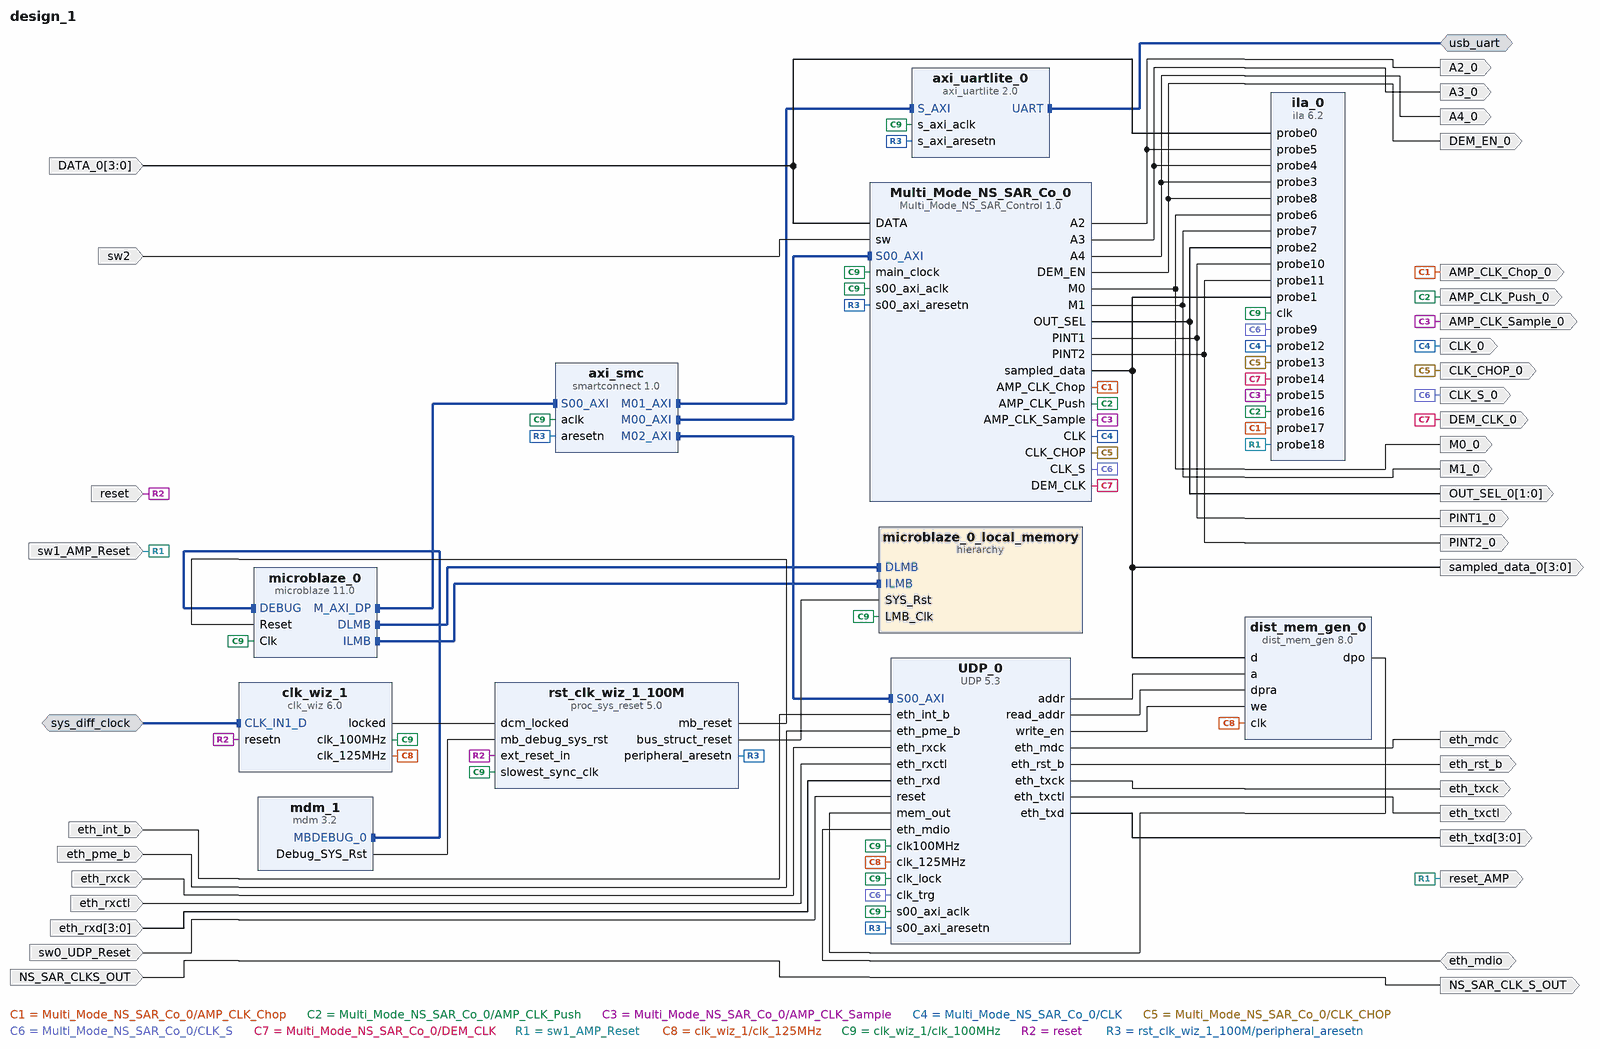
[diagram p0: block diagram of the top level]
# Vivado block design design_1, xc7k325tffg900-2, Vivado 2025.2
create_bd_design design_1

create_bd_intf_port -mode Slave -vlnv xilinx.com:interface:diff_clock_rtl:1.0 sys_diff_clock
set_property -dict {CONFIG.FREQ_HZ 200000000} [get_bd_intf_ports sys_diff_clock]
create_bd_intf_port -mode Master -vlnv xilinx.com:interface:uart_rtl:1.0 usb_uart
create_bd_port -dir I -type rst reset
set_property -dict {CONFIG.POLARITY ACTIVE_LOW} [get_bd_ports reset]
create_bd_port -dir I -from 3 -to 0 DATA_0
create_bd_port -dir O -from 3 -to 0 sampled_data_0
create_bd_port -dir O A4_0
create_bd_port -dir O A3_0
create_bd_port -dir O A2_0
create_bd_port -dir O M0_0
create_bd_port -dir O M1_0
create_bd_port -dir O -from 1 -to 0 OUT_SEL_0
create_bd_port -dir O DEM_EN_0
create_bd_port -dir O CLK_S_0
create_bd_port -dir O PINT1_0
create_bd_port -dir O PINT2_0
create_bd_port -dir O -type clk CLK_0
create_bd_port -dir O CLK_CHOP_0
create_bd_port -dir O -type clk DEM_CLK_0
create_bd_port -dir I eth_int_b
create_bd_port -dir I eth_pme_b
create_bd_port -dir I eth_rxck
create_bd_port -dir I eth_rxctl
create_bd_port -dir I -from 3 -to 0 eth_rxd
create_bd_port -dir O eth_rst_b
create_bd_port -dir O eth_mdc
create_bd_port -dir IO eth_mdio
create_bd_port -dir O eth_txck
create_bd_port -dir O eth_txctl
create_bd_port -dir O -from 3 -to 0 eth_txd
create_bd_port -dir I sw0_UDP_Reset
create_bd_port -dir I sw1_AMP_Reset
create_bd_port -dir O AMP_CLK_Sample_0
create_bd_port -dir O AMP_CLK_Push_0
create_bd_port -dir O AMP_CLK_Chop_0
create_bd_port -dir O -type rst reset_AMP
create_bd_port -dir I NS_SAR_CLKS_OUT
create_bd_port -dir O NS_SAR_CLK_S_OUT
create_bd_port -dir I sw2

create_bd_cell -type ip -vlnv xilinx.com:ip:microblaze:11.0 microblaze_0
set_property -dict [list \
  CONFIG.C_DEBUG_ENABLED 1 \
  CONFIG.C_D_AXI 1 \
  CONFIG.C_D_LMB 1 \
  CONFIG.C_ENABLE_CONVERSION 0 \
  CONFIG.C_I_LMB 1 \
] [get_bd_cells microblaze_0]
create_bd_cell -type hier microblaze_0_local_memory
create_bd_cell -type ip -vlnv xilinx.com:ip:mdm:3.2 mdm_1
create_bd_cell -type ip -vlnv xilinx.com:ip:clk_wiz:6.0 clk_wiz_1
set_property -dict [list \
  CONFIG.CLKIN1_JITTER_PS 50.0 \
  CONFIG.CLKOUT1_DRIVES BUFG \
  CONFIG.CLKOUT1_JITTER 112.316 \
  CONFIG.CLKOUT1_PHASE_ERROR 89.971 \
  CONFIG.CLKOUT2_DRIVES BUFG \
  CONFIG.CLKOUT2_JITTER 107.523 \
  CONFIG.CLKOUT2_PHASE_ERROR 89.971 \
  CONFIG.CLKOUT2_REQUESTED_OUT_FREQ 125.000 \
  CONFIG.CLKOUT2_USED true \
  CONFIG.CLKOUT3_DRIVES BUFG \
  CONFIG.CLKOUT4_DRIVES BUFG \
  CONFIG.CLKOUT5_DRIVES BUFG \
  CONFIG.CLKOUT6_DRIVES BUFG \
  CONFIG.CLKOUT7_DRIVES BUFG \
  CONFIG.CLK_IN1_BOARD_INTERFACE sys_diff_clock \
  CONFIG.CLK_OUT1_PORT clk_100MHz \
  CONFIG.CLK_OUT2_PORT clk_125MHz \
  CONFIG.FEEDBACK_SOURCE FDBK_AUTO \
  CONFIG.MMCM_BANDWIDTH OPTIMIZED \
  CONFIG.MMCM_CLKFBOUT_MULT_F 5.000 \
  CONFIG.MMCM_CLKIN1_PERIOD 5.000 \
  CONFIG.MMCM_CLKIN2_PERIOD 10.0 \
  CONFIG.MMCM_CLKOUT0_DIVIDE_F 10.000 \
  CONFIG.MMCM_CLKOUT1_DIVIDE 8 \
  CONFIG.MMCM_COMPENSATION ZHOLD \
  CONFIG.MMCM_DIVCLK_DIVIDE 1 \
  CONFIG.NUM_OUT_CLKS 2 \
  CONFIG.PRIMITIVE MMCM \
  CONFIG.PRIM_SOURCE Differential_clock_capable_pin \
  CONFIG.RESET_BOARD_INTERFACE reset \
  CONFIG.RESET_PORT resetn \
  CONFIG.RESET_TYPE ACTIVE_LOW \
  CONFIG.USE_BOARD_FLOW true \
] [get_bd_cells clk_wiz_1]
create_bd_cell -type ip -vlnv xilinx.com:ip:proc_sys_reset:5.0 rst_clk_wiz_1_100M
set_property -dict {CONFIG.RESET_BOARD_INTERFACE reset CONFIG.USE_BOARD_FLOW true} [get_bd_cells rst_clk_wiz_1_100M]
create_bd_cell -type ip -vlnv xilinx.com:user:Multi_Mode_NS_SAR_Control:1.0 Multi_Mode_NS_SAR_Co_0
create_bd_cell -type ip -vlnv xilinx.com:ip:smartconnect:1.0 axi_smc
set_property -dict {CONFIG.NUM_MI 3 CONFIG.NUM_SI 1} [get_bd_cells axi_smc]
create_bd_cell -type ip -vlnv xilinx.com:ip:ila:6.2 ila_0
set_property -dict [list \
  CONFIG.C_DATA_DEPTH 8192 \
  CONFIG.C_MONITOR_TYPE Native \
  CONFIG.C_NUM_OF_PROBES 19 \
  CONFIG.C_PROBE0_WIDTH 4 \
  CONFIG.C_PROBE1_WIDTH 8 \
  CONFIG.C_PROBE2_WIDTH 2 \
] [get_bd_cells ila_0]
create_bd_cell -type ip -vlnv xilinx.com:ip:axi_uartlite:2.0 axi_uartlite_0
set_property -dict {CONFIG.UARTLITE_BOARD_INTERFACE usb_uart CONFIG.USE_BOARD_FLOW true} [get_bd_cells axi_uartlite_0]
create_bd_cell -type ip -vlnv xilinx.com:ip:dist_mem_gen:8.0 dist_mem_gen_0
set_property -dict {CONFIG.data_width 8 CONFIG.depth 8192 CONFIG.memory_type simple_dual_port_ram} [get_bd_cells dist_mem_gen_0]
create_bd_cell -type ip -vlnv xilinx.com:user:UDP:5.3 UDP_0

# ---- hierarchy /microblaze_0_local_memory ----
current_bd_instance /microblaze_0_local_memory
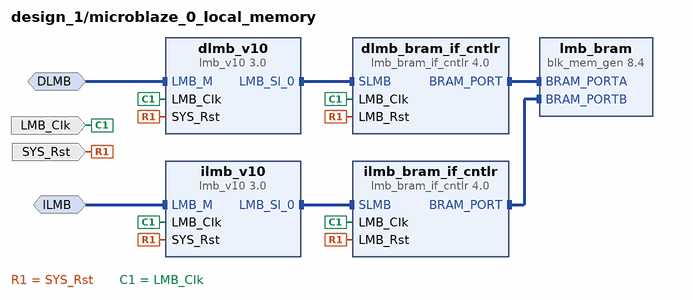
[diagram p1: block diagram inside /microblaze_0_local_memory]
create_bd_intf_pin -mode MirroredMaster -vlnv xilinx.com:interface:lmb_rtl:1.0 DLMB
create_bd_intf_pin -mode MirroredMaster -vlnv xilinx.com:interface:lmb_rtl:1.0 ILMB
create_bd_pin -dir I -type clk LMB_Clk
create_bd_pin -dir I -type rst SYS_Rst

create_bd_cell -type ip -vlnv xilinx.com:ip:lmb_v10:3.0 dlmb_v10
create_bd_cell -type ip -vlnv xilinx.com:ip:lmb_v10:3.0 ilmb_v10
create_bd_cell -type ip -vlnv xilinx.com:ip:lmb_bram_if_cntlr:4.0 dlmb_bram_if_cntlr
set_property -dict {CONFIG.C_ECC 0} [get_bd_cells dlmb_bram_if_cntlr]
create_bd_cell -type ip -vlnv xilinx.com:ip:lmb_bram_if_cntlr:4.0 ilmb_bram_if_cntlr
set_property -dict {CONFIG.C_ECC 0} [get_bd_cells ilmb_bram_if_cntlr]
create_bd_cell -type ip -vlnv xilinx.com:ip:blk_mem_gen:8.4 lmb_bram
set_property -dict {CONFIG.Memory_Type True_Dual_Port_RAM CONFIG.use_bram_block BRAM_Controller} [get_bd_cells lmb_bram]

# ---- connections ----

current_bd_instance /microblaze_0_local_memory
connect_bd_intf_net -intf_net microblaze_0_dlmb [get_bd_intf_pins dlmb_v10/LMB_M] [get_bd_intf_pins DLMB]
connect_bd_intf_net -intf_net microblaze_0_dlmb_bus [get_bd_intf_pins dlmb_v10/LMB_Sl_0] [get_bd_intf_pins dlmb_bram_if_cntlr/SLMB]
connect_bd_intf_net -intf_net microblaze_0_dlmb_cntlr [get_bd_intf_pins dlmb_bram_if_cntlr/BRAM_PORT] [get_bd_intf_pins lmb_bram/BRAM_PORTA]
connect_bd_intf_net -intf_net microblaze_0_ilmb [get_bd_intf_pins ilmb_v10/LMB_M] [get_bd_intf_pins ILMB]
connect_bd_intf_net -intf_net microblaze_0_ilmb_bus [get_bd_intf_pins ilmb_v10/LMB_Sl_0] [get_bd_intf_pins ilmb_bram_if_cntlr/SLMB]
connect_bd_intf_net -intf_net microblaze_0_ilmb_cntlr [get_bd_intf_pins ilmb_bram_if_cntlr/BRAM_PORT] [get_bd_intf_pins lmb_bram/BRAM_PORTB]
connect_bd_net [get_bd_pins SYS_Rst] \
  [get_bd_pins dlmb_v10/SYS_Rst] [get_bd_pins dlmb_bram_if_cntlr/LMB_Rst] [get_bd_pins ilmb_v10/SYS_Rst] \
  [get_bd_pins ilmb_bram_if_cntlr/LMB_Rst]
connect_bd_net -net microblaze_0_Clk [get_bd_pins LMB_Clk] \
  [get_bd_pins dlmb_v10/LMB_Clk] [get_bd_pins dlmb_bram_if_cntlr/LMB_Clk] [get_bd_pins ilmb_v10/LMB_Clk] \
  [get_bd_pins ilmb_bram_if_cntlr/LMB_Clk]
set_property HDL_ATTRIBUTE.BMM_INFO_ADDRESS_SPACE {byte  0x00000000 32 > design_1 microblaze_0_local_memory/lmb_bram} [get_bd_cells dlmb_bram_if_cntlr]
set_property HDL_ATTRIBUTE.KEEP_HIERARCHY yes [get_bd_cells dlmb_bram_if_cntlr]

current_bd_instance /
connect_bd_intf_net [get_bd_intf_pins axi_smc/M00_AXI] [get_bd_intf_pins Multi_Mode_NS_SAR_Co_0/S00_AXI]
connect_bd_intf_net [get_bd_intf_pins axi_smc/M01_AXI] [get_bd_intf_pins axi_uartlite_0/S_AXI]
connect_bd_intf_net [get_bd_intf_pins axi_smc/M02_AXI] [get_bd_intf_pins UDP_0/S00_AXI]
connect_bd_intf_net [get_bd_intf_ports usb_uart] [get_bd_intf_pins axi_uartlite_0/UART]
connect_bd_intf_net [get_bd_intf_pins microblaze_0/M_AXI_DP] [get_bd_intf_pins axi_smc/S00_AXI]
connect_bd_intf_net [get_bd_intf_pins mdm_1/MBDEBUG_0] [get_bd_intf_pins microblaze_0/DEBUG]
connect_bd_intf_net [get_bd_intf_pins microblaze_0/DLMB] [get_bd_intf_pins microblaze_0_local_memory/DLMB]
connect_bd_intf_net [get_bd_intf_pins microblaze_0/ILMB] [get_bd_intf_pins microblaze_0_local_memory/ILMB]
connect_bd_intf_net [get_bd_intf_ports sys_diff_clock] [get_bd_intf_pins clk_wiz_1/CLK_IN1_D]
connect_bd_net [get_bd_pins Multi_Mode_NS_SAR_Co_0/A2] [get_bd_ports A2_0] [get_bd_pins ila_0/probe5]
connect_bd_net [get_bd_pins Multi_Mode_NS_SAR_Co_0/A3] [get_bd_ports A3_0] [get_bd_pins ila_0/probe4]
connect_bd_net [get_bd_pins Multi_Mode_NS_SAR_Co_0/A4] [get_bd_ports A4_0] [get_bd_pins ila_0/probe3]
connect_bd_net [get_bd_pins Multi_Mode_NS_SAR_Co_0/AMP_CLK_Chop] [get_bd_ports AMP_CLK_Chop_0] [get_bd_pins ila_0/probe17]
connect_bd_net [get_bd_pins Multi_Mode_NS_SAR_Co_0/AMP_CLK_Push] [get_bd_ports AMP_CLK_Push_0] [get_bd_pins ila_0/probe16]
connect_bd_net [get_bd_pins Multi_Mode_NS_SAR_Co_0/AMP_CLK_Sample] [get_bd_ports AMP_CLK_Sample_0] [get_bd_pins ila_0/probe15]
connect_bd_net [get_bd_pins Multi_Mode_NS_SAR_Co_0/CLK] [get_bd_ports CLK_0] [get_bd_pins ila_0/probe12]
connect_bd_net [get_bd_pins Multi_Mode_NS_SAR_Co_0/CLK_CHOP] [get_bd_ports CLK_CHOP_0] [get_bd_pins ila_0/probe13]
connect_bd_net [get_bd_pins Multi_Mode_NS_SAR_Co_0/CLK_S] [get_bd_ports CLK_S_0] [get_bd_pins ila_0/probe9] [get_bd_pins UDP_0/clk_trg]
connect_bd_net [get_bd_pins Multi_Mode_NS_SAR_Co_0/DEM_CLK] [get_bd_ports DEM_CLK_0] [get_bd_pins ila_0/probe14]
connect_bd_net [get_bd_pins Multi_Mode_NS_SAR_Co_0/DEM_EN] [get_bd_ports DEM_EN_0] [get_bd_pins ila_0/probe8]
connect_bd_net [get_bd_pins Multi_Mode_NS_SAR_Co_0/M0] [get_bd_ports M0_0] [get_bd_pins ila_0/probe6]
connect_bd_net [get_bd_pins Multi_Mode_NS_SAR_Co_0/M1] [get_bd_ports M1_0] [get_bd_pins ila_0/probe7]
connect_bd_net [get_bd_pins Multi_Mode_NS_SAR_Co_0/OUT_SEL] [get_bd_ports OUT_SEL_0] [get_bd_pins ila_0/probe2]
connect_bd_net [get_bd_pins Multi_Mode_NS_SAR_Co_0/PINT1] [get_bd_ports PINT1_0] [get_bd_pins ila_0/probe10]
connect_bd_net [get_bd_pins Multi_Mode_NS_SAR_Co_0/PINT2] [get_bd_ports PINT2_0] [get_bd_pins ila_0/probe11]
connect_bd_net -net Multi_Mode_NS_SAR_Co_0_reset [get_bd_ports sw1_AMP_Reset] [get_bd_ports reset_AMP] [get_bd_pins ila_0/probe18]
connect_bd_net [get_bd_pins Multi_Mode_NS_SAR_Co_0/sampled_data] \
  [get_bd_ports sampled_data_0] [get_bd_pins ila_0/probe1] [get_bd_pins dist_mem_gen_0/d]
connect_bd_net [get_bd_ports NS_SAR_CLKS_OUT] [get_bd_ports NS_SAR_CLK_S_OUT]
connect_bd_net [get_bd_ports eth_mdio] [get_bd_pins UDP_0/eth_mdio]
connect_bd_net [get_bd_pins UDP_0/addr] [get_bd_pins dist_mem_gen_0/a]
connect_bd_net [get_bd_pins UDP_0/eth_mdc] [get_bd_ports eth_mdc]
connect_bd_net [get_bd_pins UDP_0/eth_rst_b] [get_bd_ports eth_rst_b]
connect_bd_net [get_bd_pins UDP_0/eth_txck] [get_bd_ports eth_txck]
connect_bd_net [get_bd_pins UDP_0/eth_txctl] [get_bd_ports eth_txctl]
connect_bd_net [get_bd_pins UDP_0/eth_txd] [get_bd_ports eth_txd]
connect_bd_net [get_bd_pins UDP_0/read_addr] [get_bd_pins dist_mem_gen_0/dpra]
connect_bd_net [get_bd_pins UDP_0/write_en] [get_bd_pins dist_mem_gen_0/we]
connect_bd_net -net c_counter_binary_0_Q [get_bd_ports DATA_0] [get_bd_pins ila_0/probe0] [get_bd_pins Multi_Mode_NS_SAR_Co_0/DATA]
connect_bd_net [get_bd_pins clk_wiz_1/clk_125MHz] [get_bd_pins UDP_0/clk_125MHz] [get_bd_pins dist_mem_gen_0/clk]
connect_bd_net [get_bd_pins clk_wiz_1/locked] [get_bd_pins rst_clk_wiz_1_100M/dcm_locked]
connect_bd_net [get_bd_pins dist_mem_gen_0/dpo] [get_bd_pins UDP_0/mem_out]
connect_bd_net -net eth_int_b_0_1 [get_bd_ports eth_int_b] [get_bd_pins UDP_0/eth_int_b]
connect_bd_net -net eth_pme_b_0_1 [get_bd_ports eth_pme_b] [get_bd_pins UDP_0/eth_pme_b]
connect_bd_net -net eth_rxck_0_1 [get_bd_ports eth_rxck] [get_bd_pins UDP_0/eth_rxck]
connect_bd_net -net eth_rxctl_0_1 [get_bd_ports eth_rxctl] [get_bd_pins UDP_0/eth_rxctl]
connect_bd_net -net eth_rxd_0_1 [get_bd_ports eth_rxd] [get_bd_pins UDP_0/eth_rxd]
connect_bd_net [get_bd_pins mdm_1/Debug_SYS_Rst] [get_bd_pins rst_clk_wiz_1_100M/mb_debug_sys_rst]
connect_bd_net -net microblaze_0_Clk [get_bd_pins clk_wiz_1/clk_100MHz] \
  [get_bd_pins microblaze_0/Clk] [get_bd_pins microblaze_0_local_memory/LMB_Clk] \
  [get_bd_pins rst_clk_wiz_1_100M/slowest_sync_clk] [get_bd_pins axi_smc/aclk] [get_bd_pins ila_0/clk] \
  [get_bd_pins axi_uartlite_0/s_axi_aclk] [get_bd_pins UDP_0/s00_axi_aclk] [get_bd_pins UDP_0/clk100MHz] \
  [get_bd_pins UDP_0/clk_lock] [get_bd_pins Multi_Mode_NS_SAR_Co_0/main_clock] \
  [get_bd_pins Multi_Mode_NS_SAR_Co_0/s00_axi_aclk]
connect_bd_net [get_bd_ports reset] [get_bd_pins clk_wiz_1/resetn] [get_bd_pins rst_clk_wiz_1_100M/ext_reset_in]
connect_bd_net [get_bd_pins rst_clk_wiz_1_100M/bus_struct_reset] [get_bd_pins microblaze_0_local_memory/SYS_Rst]
connect_bd_net [get_bd_pins rst_clk_wiz_1_100M/mb_reset] [get_bd_pins microblaze_0/Reset]
connect_bd_net [get_bd_pins rst_clk_wiz_1_100M/peripheral_aresetn] \
  [get_bd_pins axi_smc/aresetn] [get_bd_pins axi_uartlite_0/s_axi_aresetn] [get_bd_pins UDP_0/s00_axi_aresetn] \
  [get_bd_pins Multi_Mode_NS_SAR_Co_0/s00_axi_aresetn]
connect_bd_net [get_bd_ports sw0_UDP_Reset] [get_bd_pins UDP_0/reset]
connect_bd_net -net sw2_1 [get_bd_ports sw2] [get_bd_pins Multi_Mode_NS_SAR_Co_0/sw]
set_property HDL_ATTRIBUTE.BMM_INFO_PROCESSOR {microblaze-le > design_1 microblaze_0_local_memory/dlmb_bram_if_cntlr} [get_bd_cells microblaze_0]
set_property HDL_ATTRIBUTE.KEEP_HIERARCHY yes [get_bd_cells microblaze_0]

# ---- address map ----
assign_bd_address -offset 0x00000000 -range 64K -target_address_space [get_bd_addr_spaces microblaze_0/Data] [get_bd_addr_segs microblaze_0_local_memory/dlmb_bram_if_cntlr/SLMB/Mem]
assign_bd_address -offset 0x40600000 -range 64K -target_address_space [get_bd_addr_spaces microblaze_0/Data] [get_bd_addr_segs axi_uartlite_0/S_AXI/Reg]
assign_bd_address -offset 0x44A00000 -range 64K -target_address_space [get_bd_addr_spaces microblaze_0/Data] [get_bd_addr_segs Multi_Mode_NS_SAR_Co_0/S00_AXI/S00_AXI_reg]
assign_bd_address -offset 0x44A10000 -range 64K -target_address_space [get_bd_addr_spaces microblaze_0/Data] [get_bd_addr_segs UDP_0/S00_AXI/S00_AXI_reg]
assign_bd_address -offset 0x00000000 -range 64K -target_address_space [get_bd_addr_spaces microblaze_0/Instruction] [get_bd_addr_segs microblaze_0_local_memory/ilmb_bram_if_cntlr/SLMB/Mem]

validate_bd_design
save_bd_design
